# Altium project PilotPi_Sensors.PrjPcb
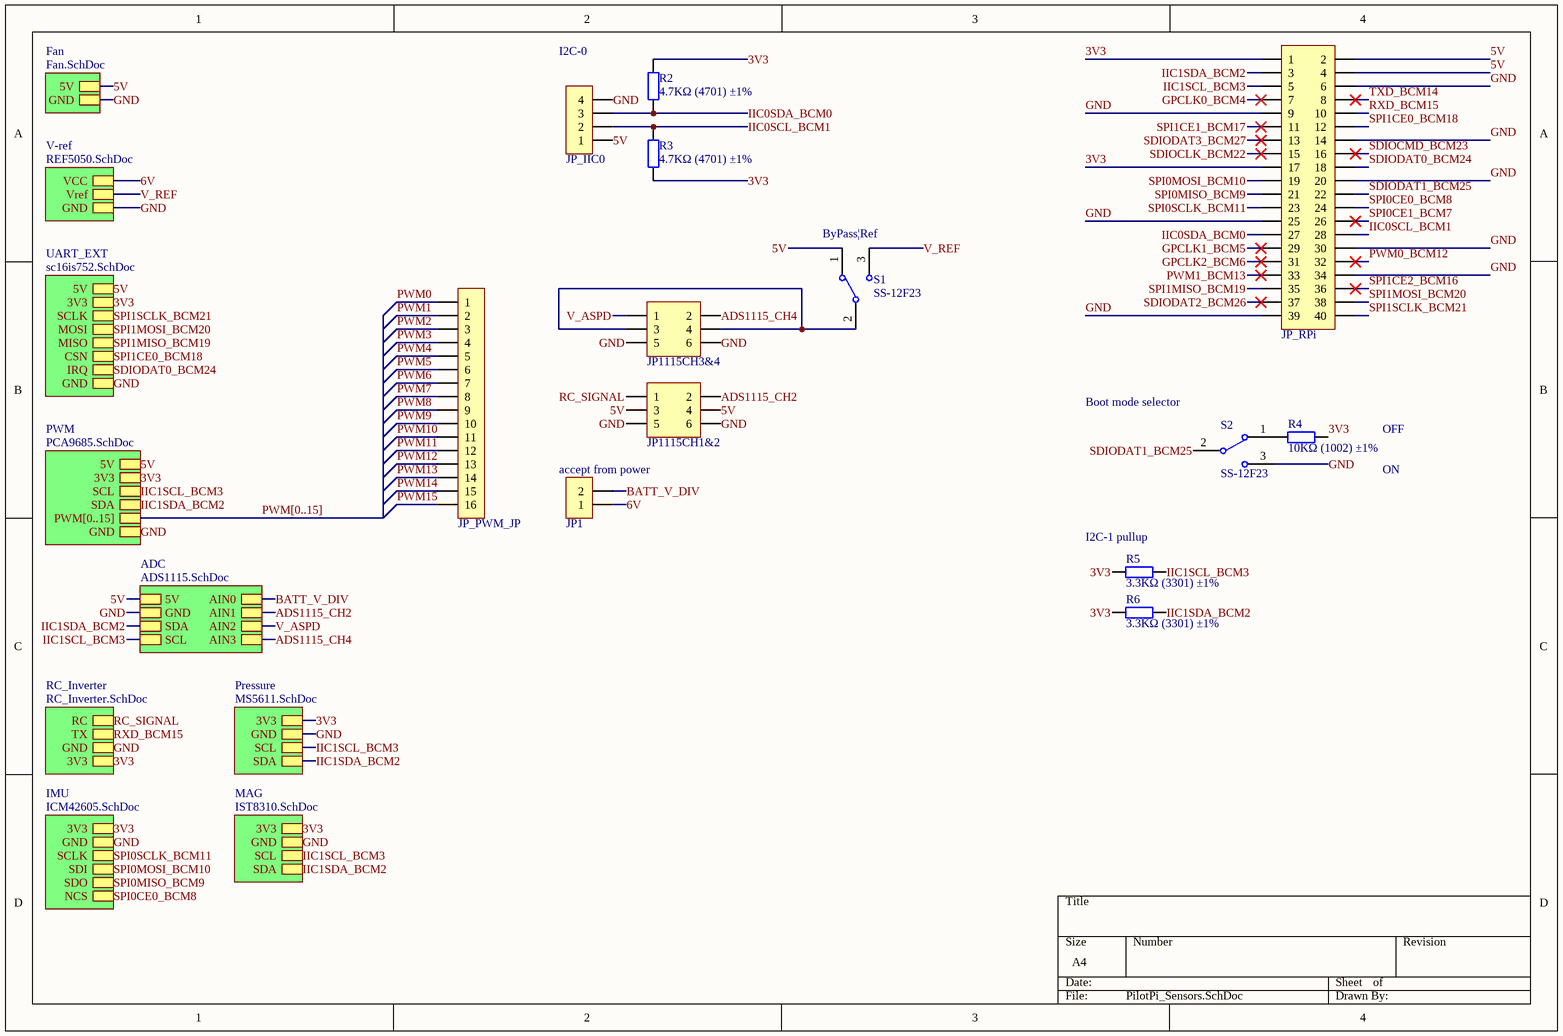
[diagram p0: PilotPi_Sensors.SchDoc]
5 sheets, 45 parts. Net scope: hierarchical (ports join the sheet entries above them; power ports are global).
Board file: PilotPi_Sensors.PcbDoc
Sheets:
  PilotPi_Sensors.SchDoc
    V-ref = REF5050.SchDoc
    UART_EXT = sc16is752.SchDoc
    Pressure = MS5611.SchDoc
    MAG = IST8310.SchDoc

## Sheet PilotPi_Sensors.SchDoc
size A4

### Parts
JP1  HDR-1X2  [HDR2.54-LI-2P]  (value not drawn)
JP1115CH1&2  Header3X2  [HDR2.54-WI-2x3P]  (value not drawn)
JP1115CH3&4  Header3X2  [HDR2.54-WI-2x3P]  (value not drawn)
JP_IIC0  HDR-1X4  [MX 1.25-WS-4P]  (value not drawn)
JP_PWM_JP  HDR-1X16  [HDR2.54-LI-16P]  (value not drawn)
JP_RPi  Header 2X11  [HDR2.54-LI-2x20P]  (value not drawn)
R2  4.7KΩ (4701) ±1%  [0402_R]
R3  4.7KΩ (4701) ±1%  [0402_R]
R4  10KΩ (1002) ±1%  [0402_R]
R5  3.3KΩ (3301) ±1%  [0402_R]
R6  3.3KΩ (3301) ±1%  [0402_R]
S1  SS-12F23  [MSK-12C01-07]
S2  SS-12F23  [MSK-12C01-07]

### Sub-sheets
ADC = ADS1115.SchDoc (file not in this document): SDA, AIN0, AIN3, AIN1, AIN2, 5V, GND, SCL
Fan = Fan.SchDoc (file not in this document): 5V, GND
IMU = ICM42605.SchDoc (file not in this document): NCS, 3V3, GND, SCLK, SDI, SDO
MAG = IST8310.SchDoc: GND, SCL, 3V3, SDA
Pressure = MS5611.SchDoc: 3V3, SCL, GND, SDA
PWM = PCA9685.SchDoc (file not in this document): PWM[0..15], SDA, SCL, GND, 5V, 3V3
RC_Inverter = RC_Inverter.SchDoc (file not in this document): RC, TX, GND, 3V3
UART_EXT = sc16is752.SchDoc: CSN, 5V, SCLK, 3V3, GND, IRQ, MOSI, MISO
V-ref = REF5050.SchDoc: VCC, Vref, GND

### Nets
3V3: JP_RPi.1 JP_RPi.17 R2.2 R3.1 R4.2 R5.1 R6.1 ; sheet UART_EXT/3V3, sheet PWM/3V3, sheet RC_Inverter/3V3, sheet IMU/3V3, sheet Pressure/3V3, sheet MAG/3V3
5V: JP1115CH1&2.3 JP1115CH1&2.4 JP_IIC0.1 JP_RPi.2 JP_RPi.4 S1.1 ; sheet Fan/5V, sheet UART_EXT/5V, sheet PWM/5V, sheet ADC/5V
6V: JP1.1 ; sheet V-ref/VCC
ADS1115_CH2: JP1115CH1&2.2 ; sheet ADC/AIN1
ADS1115_CH4: JP1115CH3&4.2 ; sheet ADC/AIN3
BATT_V_DIV: JP1.2 ; sheet ADC/AIN0
GND: JP1115CH1&2.5 JP1115CH1&2.6 JP1115CH3&4.5 JP1115CH3&4.6 JP_IIC0.4 JP_RPi.6 JP_RPi.9 JP_RPi.14 JP_RPi.20 JP_RPi.25 JP_RPi.30 JP_RPi.34 JP_RPi.39 S2.3 ; sheet Fan/GND, sheet V-ref/GND, sheet UART_EXT/GND, sheet PWM/GND, sheet ADC/GND, sheet RC_Inverter/GND, sheet IMU/GND, sheet Pressure/GND, sheet MAG/GND
GPCLK0_BCM4: JP_RPi.7
GPCLK1_BCM5: JP_RPi.29
GPCLK2_BCM6: JP_RPi.31
IIC0SCL_BCM1: JP_IIC0.2 JP_RPi.28 R3.2
IIC0SDA_BCM0: JP_IIC0.3 JP_RPi.27 R2.1
IIC1SCL_BCM3: JP_RPi.5 R5.2 ; sheet PWM/SCL, sheet ADC/SCL, sheet Pressure/SCL, sheet MAG/SCL
IIC1SDA_BCM2: JP_RPi.3 R6.2 ; sheet PWM/SDA, sheet ADC/SDA, sheet Pressure/SDA, sheet MAG/SDA
PWM0: JP_PWM_JP.1
PWM0_BCM12: JP_RPi.32
PWM1: JP_PWM_JP.2
PWM1_BCM13: JP_RPi.33
PWM2: JP_PWM_JP.3
PWM3: JP_PWM_JP.4
PWM4: JP_PWM_JP.5
PWM5: JP_PWM_JP.6
PWM6: JP_PWM_JP.7
PWM7: JP_PWM_JP.8
PWM8: JP_PWM_JP.9
PWM9: JP_PWM_JP.10
PWM10: JP_PWM_JP.11
PWM11: JP_PWM_JP.12
PWM12: JP_PWM_JP.13
PWM13: JP_PWM_JP.14
PWM14: JP_PWM_JP.15
PWM15: JP_PWM_JP.16
RC_SIGNAL: JP1115CH1&2.1 ; sheet RC_Inverter/RC
RXD_BCM15: JP_RPi.10 ; sheet RC_Inverter/TX
SDIOCLK_BCM22: JP_RPi.15
SDIOCMD_BCM23: JP_RPi.16
SDIODAT0_BCM24: JP_RPi.18 ; sheet UART_EXT/IRQ  [project net IRQ]
SDIODAT1_BCM25: JP_RPi.22 S2.2
SDIODAT2_BCM26: JP_RPi.37
SDIODAT3_BCM27: JP_RPi.13
SPI0CE0_BCM8: JP_RPi.24 ; sheet IMU/NCS
SPI0CE1_BCM7: JP_RPi.26
SPI0MISO_BCM9: JP_RPi.21 ; sheet IMU/SDO
SPI0MOSI_BCM10: JP_RPi.19 ; sheet IMU/SDI
SPI0SCLK_BCM11: JP_RPi.23 ; sheet IMU/SCLK
SPI1CE0_BCM18: JP_RPi.12 ; sheet UART_EXT/CSN  [project net CSN]
SPI1CE1_BCM17: JP_RPi.11
SPI1CE2_BCM16: JP_RPi.36
SPI1MISO_BCM19: JP_RPi.35 ; sheet UART_EXT/MISO  [project net MISO]
SPI1MOSI_BCM20: JP_RPi.38 ; sheet UART_EXT/MOSI  [project net MOSI]
SPI1SCLK_BCM21: JP_RPi.40 ; sheet UART_EXT/SCLK  [project net SCLK]
TXD_BCM14: JP_RPi.8
V_ASPD: JP1115CH3&4.1 ; sheet ADC/AIN2
V_REF: S1.3 ; sheet V-ref/Vref
NetJP1115CH3&4_3: JP1115CH3&4.3 JP1115CH3&4.4 S1.2
NetR4_1: R4.1 S2.1

### Buses and harness runs
bus PWM[0..15] = sheet PWM/PWM[0..15]

### Notes on the sheet
- (near JP_IIC0) I2C-0
- (near S1) ByPass|Ref
- (near S2) Boot mode selector
- OFF
- (near JP1) accept from power
- ON
- (near R5) I2C-1 pullup

### Library data of the parts
JP1 = Header 2: 2P接插件; 版权归属: 源创客; BOM名称: 2P接插件; 学习资源: www.ooocke.com
JP1115CH1&2 JP1115CH3&4 = Header 3X2: 3*2P接插件; 版权归属: 源创客; BOM名称: 3*2P接插件; 学习资源: www.ooocke.com
JP_IIC0 = Header 4: 4P接插件; 版权归属: 源创客; BOM名称: 4P接插件; 学习资源: www.ooocke.com
JP_PWM_JP = Header 16: 16P接插件; 版权归属: 源创客; BOM名称: 16P接插件; 学习资源: www.ooocke.com
JP_RPi = Header 20X2: 20*2P接插件; 版权归属: 源创客; BOM名称: 20*2P接插件; 学习资源: www.ooocke.com
R2 R3 = 0402 4.7KΩ (4701) 1%: 贴片电阻; ComponentLink1Description: 供应商链接; ComponentLink1URL: http://www.szlcsc.com/product/details_26643.html; Package: 0402; Supplier: LC; SuppliersPartNumber: C25900
R4 = 0402 10KΩ (1002) 1%: 贴片电阻; ComponentLink1Description: 供应商链接; ComponentLink1URL: http://www.szlcsc.com/product/details_26487.html; Package: 0402; Supplier: LC; SuppliersPartNumber: C25744
R5 R6 = 0402 3.3KΩ (3301) 1%: 贴片电阻; ComponentLink1Description: 供应商链接; ComponentLink1URL: http://www.szlcsc.com/product/details_26633.html; Package: 0402; Supplier: LC; SuppliersPartNumber: C25890
S1 S2 = SSW-1P: 1路波动开关; BOM名称: 波动开关; 版权归属: 源创客; 学习资源: www.ooocke.com

## Sheet REF5050.SchDoc
size A4
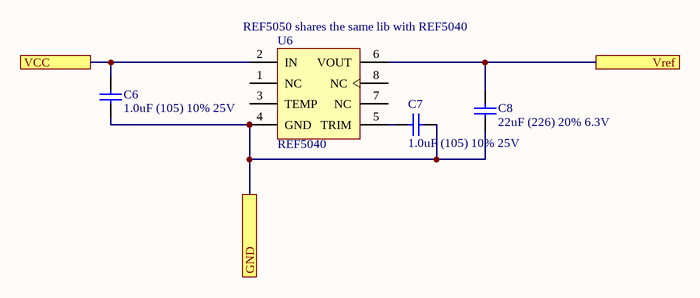
[diagram p1: REF5050.SchDoc]

### Parts
C6  1.0uF (105) 10% 25V  [0402_C]
C7  1.0uF (105) 10% 25V  [0402_C]
C8  22uF (226) 20% 6.3V  [0603_C]
U6  REF5040  [SOP8_N]

### Ports
GND, VCC, Vref

### Nets
6V: C6.2 U6.2(IN) ; port VCC
GND: C6.1 C7.2 C8.1 U6.4(GND) ; port GND
V_REF: C8.2 U6.6(VOUT) ; port Vref
NetC7_1: C7.1 U6.5(TRIM)

Not connected (* = marked no-connect by the designer): U6 1(NC) 3(TEMP) 7(NC) 8(NC)

### Notes on the sheet
- (near U6) REF5050 shares the same lib with REF5040

### Library data of the parts
C6 C7 = 0402 1.0uF (105) 10% 25V: 贴片电容; ComponentLink1Description: 供应商链接; ComponentLink1URL: http://www.szlcsc.com/product/details_53938.html; Package: 0402; Supplier: LC; SuppliersPartNumber: C52923
C8 = 0603 22uF (226) 20% 6.3V: 贴片电容; ComponentLink1Description: 供应商链接; ComponentLink1URL: http://www.szlcsc.com/product/details_60514.html; Package: 0603; Supplier: LC; SuppliersPartNumber: C59461
U6 = REF5040: 高精度电压基准; 版权归属: 源创客; BOM名称: 高精度电压基准; 学习资源: www.ooocke.com

## Sheet sc16is752.SchDoc
size A4
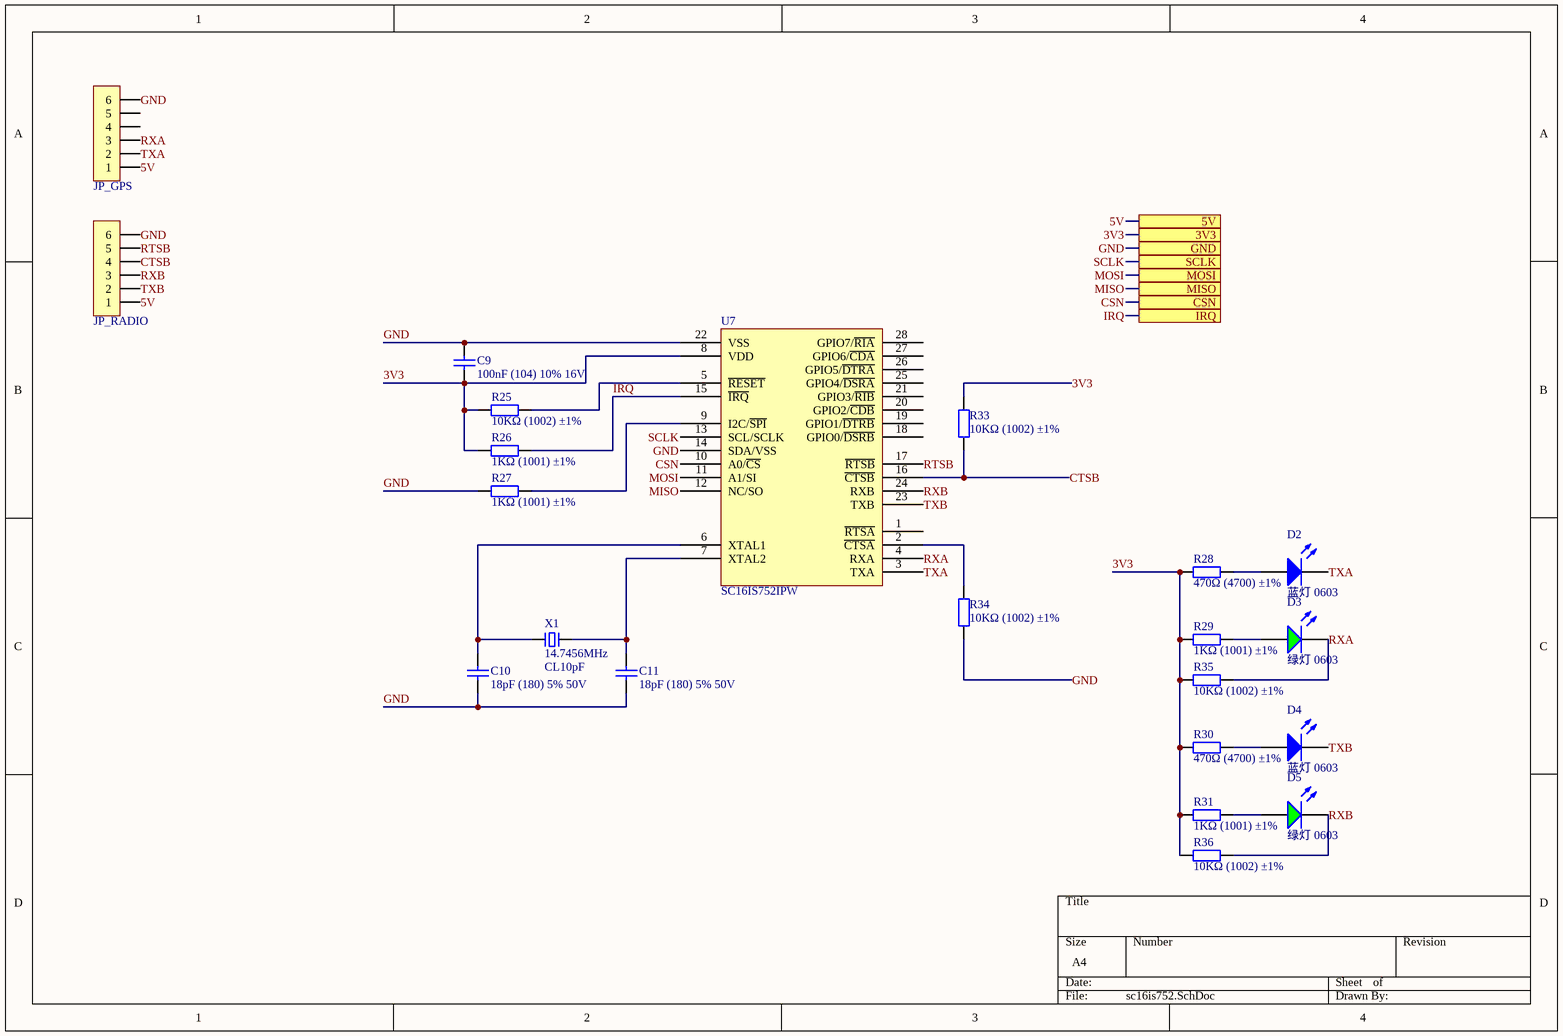
[diagram p2: sc16is752.SchDoc]

### Parts
C9  100nF (104) 10% 16V  [0402_C]
C10  18pF (180) 5% 50V  [0402_C]
C11  18pF (180) 5% 50V  [0402_C]
D2  蓝灯 0603  [0603_LED_S1]
D3  绿灯 0603  [0603_LED_S1]
D4  蓝灯 0603  [0603_LED_S1]
D5  绿灯 0603  [0603_LED_S1]
JP_GPS  HDR-1X6  [MX 1.25-WS-6P]  (value not drawn)
JP_RADIO  HDR-1X6  [MX 1.25-WS-6P]  (value not drawn)
R25  10KΩ (1002) ±1%  [0402_R]
R26  1KΩ (1001) ±1%  [0402_R]
R27  1KΩ (1001) ±1%  [0402_R]
R28  470Ω (4700) ±1%  [0402_R]
R29  1KΩ (1001) ±1%  [0402_R]
R30  470Ω (4700) ±1%  [0402_R]
R31  1KΩ (1001) ±1%  [0402_R]
R33  10KΩ (1002) ±1%  [0402_R]
R34  10KΩ (1002) ±1%  [0402_R]
R35  10KΩ (1002) ±1%  [0402_R]
R36  10KΩ (1002) ±1%  [0402_R]
U7  SC16IS752IPW  [TSSOP28_n]
X1  14.7456MHz  负载电容: CL10pF  [OSC HC-49SMD]

### Ports
3V3, 5V, CSN, GND, IRQ, MISO, MOSI, SCLK

### Nets
3V3: C9.1 R25.1 R26.1 R28.1 R29.1 R30.1 R31.1 R33.2 R35.2 R36.2 U7.8(VDD) ; port 3V3
5V: JP_GPS.1 JP_RADIO.1 ; port 5V
CSN: U7.10(A0/~{CS}) ; port CSN
CTSB: JP_RADIO.4 R33.1 U7.16(~{CTSB})
GND: C9.2 C10.1 C11.1 JP_GPS.6 JP_RADIO.6 R27.1 R34.1 U7.14(SDA/VSS) U7.22(VSS) ; port GND
IRQ: R26.2 U7.15(~{IRQ}) ; port IRQ
MISO: U7.12(NC/SO) ; port MISO
MOSI: U7.11(A1/SI) ; port MOSI
RTSB: JP_RADIO.5 U7.17(~{RTSB})
RXA: D3.K JP_GPS.3 R35.1 U7.4(RXA)
RXB: D5.K JP_RADIO.3 R36.1 U7.24(RXB)
SCLK: U7.13(SCL/SCLK) ; port SCLK
TXA: D2.K JP_GPS.2 U7.3(TXA)
TXB: D4.K JP_RADIO.2 U7.23(TXB)
NetC10_2: C10.2 U7.6(XTAL1) X1.1
NetC11_2: C11.2 U7.7(XTAL2) X1.2
NetD2_A: D2.A R28.2
NetD3_A: D3.A R29.2
NetD4_A: D4.A R30.2
NetD5_A: D5.A R31.2
NetR25_2: R25.2 U7.5(~{RESET})
NetR27_2: R27.2 U7.9(I2C/~{SPI})
NetR34_2: R34.2 U7.2(~{CTSA})

Not connected (* = marked no-connect by the designer): JP_GPS 4 5; U7 1(~{RTSA}) 18(GPIO0/~{DSRB}) 19(GPIO1/~{DTRB}) 20(GPIO2/~{CDB}) 21(GPIO3/~{RIB}) 25(GPIO4/~{DSRA}) 26(GPIO5/~{DTRA}) 27(GPIO6/~{CDA}) 28(GPIO7/~{RIA})

### Library data of the parts
C9 = 0402 100nF (104) 10% 16V: 贴片电容; ComponentLink1Description: 供应商链接; ComponentLink1URL: http://www.szlcsc.com/product/details_1877.html; Package: 0402; Supplier: LC; SuppliersPartNumber: C1525
C10 C11 = 0402 18pF (180) 5% 50V: 贴片电容; ComponentLink1Description: 供应商链接; ComponentLink1URL: http://www.szlcsc.com/product/details_1901.html; Package: 0402; Supplier: LC; SuppliersPartNumber: C1549
D2 D4 = 0603 蓝灯: 发光二极管; ComponentLink1Description: 供应商链接; ComponentLink1URL: http://www.szlcsc.com/product/details_73150.html; Package: 0603; Supplier: LC; SuppliersPartNumber: C72041
D3 D5 = 0603 绿灯: 发光二极管; ComponentLink1Description: 供应商链接; ComponentLink1URL: http://www.szlcsc.com/product/details_73152.html; Package: 0603; Supplier: LC; SuppliersPartNumber: C72043
JP_GPS JP_RADIO = Header 6: 6P接插件; 版权归属: 源创客; BOM名称: 6P接插件; 学习资源: www.ooocke.com
R25 R33-R36 = 0402 10KΩ (1002) 1%: 贴片电阻; ComponentLink1Description: 供应商链接; ComponentLink1URL: http://www.szlcsc.com/product/details_26487.html; Package: 0402; Supplier: LC; SuppliersPartNumber: C25744
R26 R27 R29 R31 = 0402 1KΩ (1001) 1%: 贴片电阻; ComponentLink1Description: 供应商链接; ComponentLink1URL: http://www.szlcsc.com/product/details_12256.html; Package: 0402; Supplier: LC; SuppliersPartNumber: C11702
R28 R30 = 0402 470Ω (4700) 1%: 贴片电阻; ComponentLink1Description: 供应商链接; ComponentLink1URL: http://www.szlcsc.com/product/details_25860.html; Package: 0402; Supplier: LC; SuppliersPartNumber: C25117
X1 = XTAL-2P: 2脚无源脚晶振; 版权归属: 源创客; BOM名称: 2脚无源脚晶振; 学习资源: www.ooocke.com

## Sheet MS5611.SchDoc
size A4
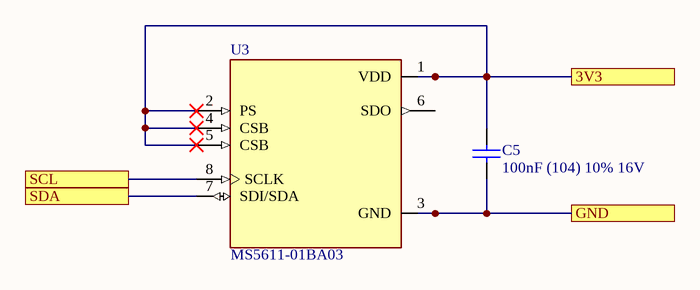
[diagram p3: MS5611.SchDoc]

### Parts
C5  100nF (104) 10% 16V  [0402_C]
U3  MS5611-01BA03  [SON125P500X300X100-8N]

### Ports
3V3, GND, SCL, SDA

### Nets
3V3: C5.2 U3.1(VDD) U3.2(PS) U3.4(CSB) U3.5(CSB) ; port 3V3
GND: C5.1 U3.3(GND) ; port GND
IIC1SCL_BCM3: U3.8(SCLK) ; port SCL
IIC1SDA_BCM2: U3.7(SDI/SDA) ; port SDA

Not connected (* = marked no-connect by the designer): U3 6(SDO)

### Library data of the parts
C5 = 0402 100nF (104) 10% 16V: 贴片电容; ComponentLink1Description: 供应商链接; ComponentLink1URL: http://www.szlcsc.com/product/details_1877.html; Package: 0402; Supplier: LC; SuppliersPartNumber: C1525
U3 = MS5611-01BA03: Pressure Sensor 0.15PSI ~ 17.4PSI _1kPa ~ 120kPa_ Absolute 24 b 8-SMD; MF: TE Connectivity; Price: None; Availability: Unavailable; TE_purchase_URL: https://www.te.com/usa-en/product-MS5611-01BA03.html?te_bu=Cor&te_type=disp&te_campaign=seda_glo_cor-seda-global-disp-prtnr-fy19-seda-model-bom-cta_sma-317_1&elqCampaignId=32493; Value: *; MP: MS5611-01BA03; SnapEDA_Link: https://www.snapeda.com/parts/MS5611-01BA03/TE%20Connectivity%20ALCOSWITCH%20Switches/view-part/2889268/?ref=snap; Package: SMD-8 TE Connectivity

## Sheet IST8310.SchDoc
size A4
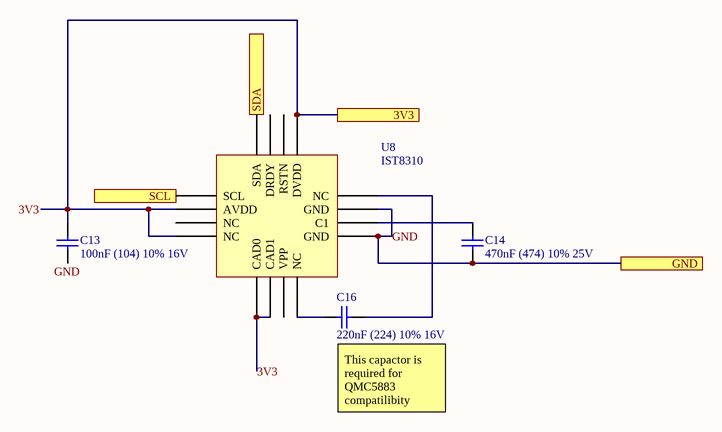
[diagram p4: IST8310.SchDoc]

### Parts
C13  100nF (104) 10% 16V  [0402_C]
C14  470nF (474) 10% 25V  [0603_C]
C16  220nF (224) 10% 16V  [0402_C]
U8  IST8310  [IST8310_LGA16]

### Ports
3V3, GND, SCL, SDA

### Nets
3V3: C13.1 U8.2(AVDD) U8.4(NC) U8.5(CAD0) U8.6(CAD1) U8.13(DVDD) ; port 3V3
GND: C13.2 C14.1 U8.9(GND) U8.11(GND) ; port GND
IIC1SCL_BCM3: U8.1(SCL) ; port SCL
IIC1SDA_BCM2: U8.16(SDA) ; port SDA
NetC14_2: C14.2 U8.10(C1)
NetC16_1: C16.1 U8.12(NC)
NetC16_2: C16.2 U8.8(NC)

Not connected (* = marked no-connect by the designer): U8 3(NC) 7(VPP) 14(RSTN) 15(DRDY)

### Notes on the sheet
- (near C16) This capactor is required for QMC5883 compatilibity

### Library data of the parts
C13 = 0402 100nF (104) 10% 16V: 贴片电容; ComponentLink1Description: 供应商链接; ComponentLink1URL: http://www.szlcsc.com/product/details_1877.html; Package: 0402; Supplier: LC; SuppliersPartNumber: C1525
C14 = 0603 470nF (474) 10% 25V: 贴片电容; ComponentLink1Description: 供应商链接; ComponentLink1URL: http://www.szlcsc.com/product/details_1975.html; Package: 0603; Supplier: LC; SuppliersPartNumber: C1623
C16 = 0402 220nF (224) 10% 16V: 贴片电容; ComponentLink1Description: 供应商链接; ComponentLink1URL: http://www.szlcsc.com/product/details_17456.html; Package: 0402; Supplier: LC; SuppliersPartNumber: C16772

## Nets that join several sheets
3V3: PilotPi_Sensors (7 pins), sc16is752 (11 pins), MS5611 (5 pins), IST8310 (6 pins)
5V: PilotPi_Sensors (6 pins), sc16is752 (JP_GPS.1 JP_RADIO.1)
6V: PilotPi_Sensors (JP1.1), REF5050 (C6.2 U6.2)
CSN: PilotPi_Sensors (JP_RPi.12), sc16is752 (U7.10)
GND: PilotPi_Sensors (14 pins), REF5050 (C6.1 C7.2 C8.1 U6.4), sc16is752 (9 pins), MS5611 (C5.1 U3.3), IST8310 (C13.2 C14.1 U8.9 U8.11)
IIC1SCL_BCM3: PilotPi_Sensors (JP_RPi.5 R5.2), MS5611 (U3.8), IST8310 (U8.1)
IIC1SDA_BCM2: PilotPi_Sensors (JP_RPi.3 R6.2), MS5611 (U3.7), IST8310 (U8.16)
IRQ: PilotPi_Sensors (JP_RPi.18), sc16is752 (R26.2 U7.15)
MISO: PilotPi_Sensors (JP_RPi.35), sc16is752 (U7.12)
MOSI: PilotPi_Sensors (JP_RPi.38), sc16is752 (U7.11)
SCLK: PilotPi_Sensors (JP_RPi.40), sc16is752 (U7.13)
V_REF: PilotPi_Sensors (S1.3), REF5050 (C8.2 U6.6)